# Altium schematic sheet MCU_NODE.SchDoc
size A
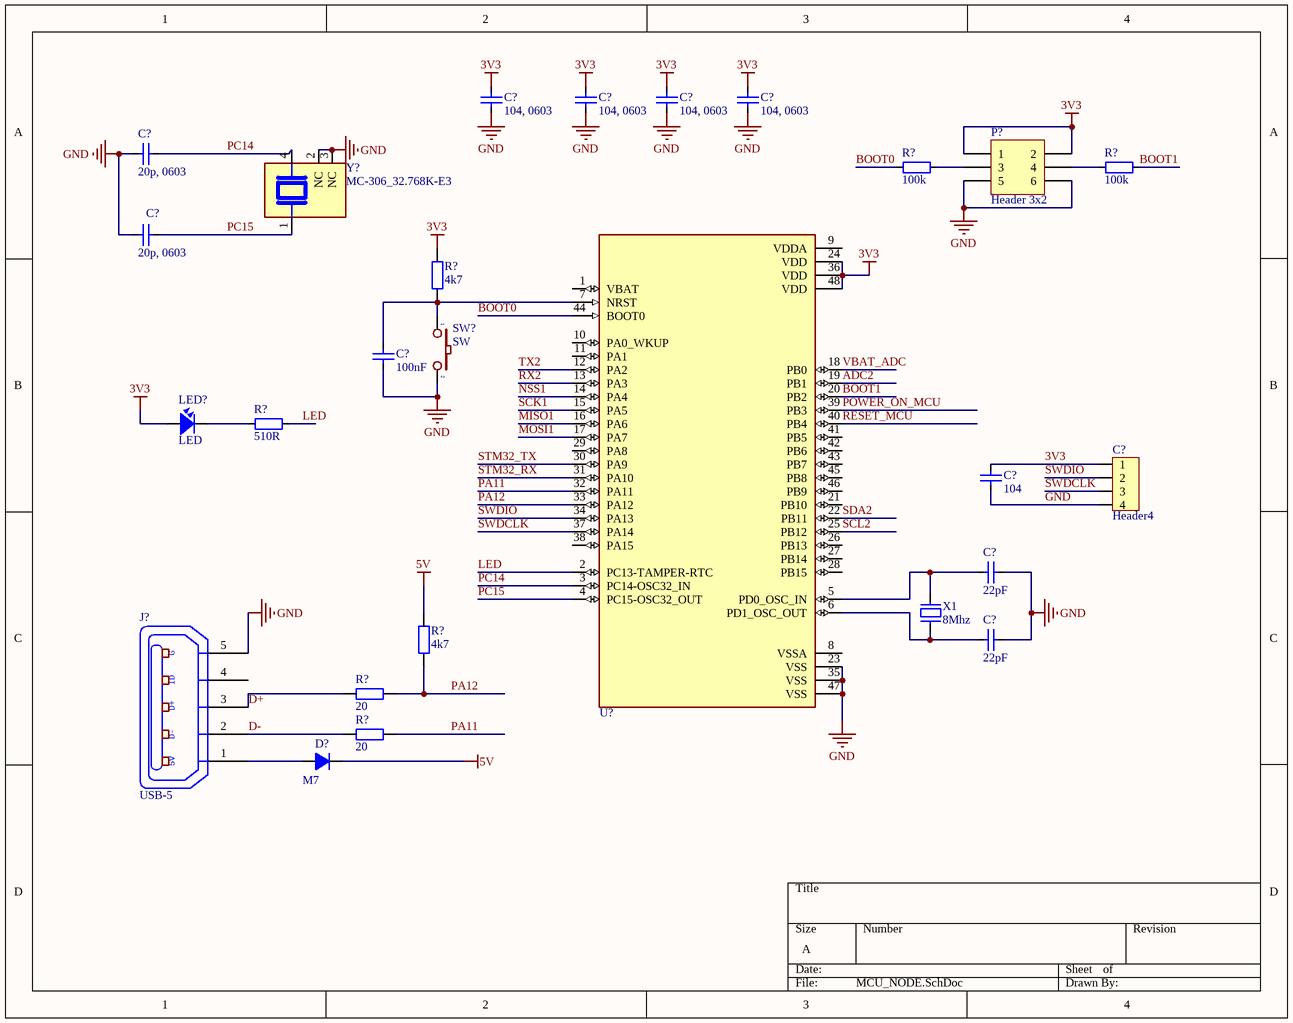
[diagram p0: MCU_NODE.SchDoc]

## Parts
(Parts that share a designator on the sheet are numbered #1, #2 ... from top to bottom, then left to right.)
C?#1  104, 0603  [CAP_0805]
C?#2  104, 0603  [CAP_0805]
C?#3  104, 0603  [CAP_0805]
C?#4  104, 0603  [CAP_0805]
C?#5  20p, 0603  [CAP_0805]
C?#6  20p, 0603  [CAP_0805]
C?#7  100nF  [CAP_0402]
C?#8  Header4  [HDR4]
C?#9  104  [CAP_0402]
C?#10  22pF  [CAP_0402]
C?#11  22pF  [CAP_0402]
D?  M7  [LED-0805-Blue]
J?  USB-5  [USB-M1]
LED?  LED  [LED-0805-Blue]
P?  Header 3x2  [Header 3x2]
R?#1  100k  [RES-SMD-0805]
R?#2  100k  [RES-SMD-0805]
R?#3  4k7  [RES-SMD-0805]
R?#4  510R  [RES-SMD-0805]
R?#5  4k7  [RES-SMD-0805]
R?#6  20  [RES-SMD-0805]
R?#7  20  [RES-SMD-0101]
SW?  SW  [SW2]
U?  STM32  [LQFP 48]  (value not drawn)
X1  8Mhz  [XT2]
Y?  MC-306_32.768K-E3  [XTAL_MC-306_32.768K-E3]

## Nets
3V3: C?#1.2 C?#2.2 C?#3.2 C?#4.2 C?#8.1 C?#9.2 LED?.1 P?.1 P?.2 R?#3.1 U?.24(VDD) U?.36(VDD) U?.48(VDD)
5V: D?.2(K) R?#5.2
GND: C?#1.1 C?#2.1 C?#3.1 C?#4.1 C?#5.1 C?#6.1 C?#7.1 C?#8.4 C?#9.1 C?#10.2 C?#11.2 J?.5(P5) P?.5 P?.6 SW?.2 U?.23(VSS) U?.35(VSS) U?.47(VSS) Y?.2(NC) Y?.3(NC)
ADC2: U?.19(PB1)
BOOT0: R?#1.2 U?.44(BOOT0)
BOOT1: R?#2.1 U?.20(PB2)
D+: J?.3(P3) R?#6.1
D-: J?.2(P2) R?#7.1
LED: R?#4.1 U?.2(PC13-TAMPER-RTC)
MISO1: U?.16(PA6)
MOSI1: U?.17(PA7)
NSS1: U?.14(PA4)
PA11: R?#7.2 U?.32(PA11)
PA12: R?#5.1 R?#6.2 U?.33(PA12)
PC14: C?#5.2 U?.3(PC14-OSC32_IN) Y?.4
PC15: C?#6.2 U?.4(PC15-OSC32_OUT) Y?.1
POWER_ON_MCU: U?.39(PB3)
RESET_MCU: U?.40(PB4)
RX2: U?.13(PA3)
SCK1: U?.15(PA5)
SCL2: U?.25(PB12)
SDA2: U?.22(PB11)
STM32_RX: U?.31(PA10)
STM32_TX: U?.30(PA9)
SWDCLK: C?#8.3 U?.37(PA14)
SWDIO: C?#8.2 U?.34(PA13)
TX2: U?.12(PA2)
VBAT_ADC: U?.18(PB0)
NetC?#7_2: C?#7.2 R?#3.2 SW?.1 U?.7(NRST)
NetC?#10_1: C?#10.1 U?.5(PD0_OSC_IN) X1.2
NetC?#11_1: C?#11.1 U?.6(PD1_OSC_OUT) X1.1
NetD?_1: D?.1(A) J?.1(P1)
NetLED?_2: LED?.2 R?#4.2
NetP?_3: P?.3 R?#1.1
NetP?_4: P?.4 R?#2.2

Not connected (* = marked no-connect by the designer): J? 4(P4); U? 1(VBAT) 8(VSSA) 9(VDDA) 10(PA0_WKUP) 11(PA1) 21(PB10) 26(PB13) 27(PB14) 28(PB15) 29(PA8) 38(PA15) 41(PB5) 42(PB6) 43(PB7) 45(PB8) 46(PB9)

## Notes on the sheet
- (in symbol USB-5) G; ID; D+; D-; 5V

## Library data of the parts
C?#1-C?#7 C?#9-C?#11 = CapSMD: Capacitor; Value: 33p; Published: 8-Jun-2000; LatestRevisionDate: 17-Jul-2002; LatestRevisionNote: Re-released for DXP Platform.; PackageReference: RAD-0.3; Publisher: Altium Limited
C?#8 = Header4: Header IDC, 4 x 1 Pin Vertical 2.54mm Pitch (Non-Boxed, Male); Manufacturer: W¨¹rth Elektronik eiSos GmbH; partNo: 613002143121; ComponentLink1 Description: Manufacturer; ComponentLink2 Description: Datasheet; NoPins: 02; Created Date: 29 March 2013; ComponentLink1URL: http://www.we-online.com; ComponentLink2URL: http://katalog.we-online.de/em/datasheet/6130xx143121.pdf; Created by: Karrer Zheng
D? = D1A: Diode 1A; Value: 1N4007
J? = USB-5: Manufacturer: FCI; Manufacturer Part Number: 10118193-0001LF; Connector Type: USB - micro B; Number of Contacts: 5; Gender: Receptacle; Specifications: USB 2.0; .Creator: MM; .Checked PCB: RF; Supplier 1: Digi-Key; RoHS: RoHS Compliant; Category: Connectors, Interconnects; Stock 1: 28642; Pricing 1: 1=0.46, 10=0.433, 25=0.3712, 50=0.3156, 100=0.3032, 250=0.27224, 500=0.25988 (USD); Packaging: Cut Tape (CT); Mounting Type: Surface Mount, Right Angle, Horizontal; Features: Shielded, Solder Retention; Ingress Protection: -; ComponentLink1URL: http://portal.fciconnect.com/Comergent//fci/drawing/10118193.pdf; ComponentLink1Description: http://portal.fciconnect.com/Comergent//fci/drawing/10118193.pdf; Supplier Part Number 1: 609-4616-1-ND; .Checked SCH: MM
LED? = LED: LED Single colour Green and Red; Value: LED 3 ly Single Colour
P? = Header 3x2: Header, 6-Pin, 2-Row; LatestRevisionDate: 17-Jul-2002; LatestRevisionNote: Re-released for DXP Platform.; Publisher: Altium Limited
R?#1 R?#2 R?#4 = Resistor - SMD: Resistor; Manufacturer: Generic Components; Class: Passive; Published: 08/06/2000; Publisher: Altium Hobart Technology Centre
R?#3 R?#5-R?#7 = Resistor - SMD: Resistor SMD; Manufacturer: Generic Components; Class: Passive; Published: 08/06/2000; Publisher: Altium Hobart Technology Centre
SW? = SW2: Switch button 2 pin; Value: SW chip 2 pin
U? = STM32F103C8T6: STM32 ARM-based 32-bit MCU with 64 Kbytes Flash, 64-pin LQFP, Industrial Temperature
X1 = XT2: Crystal For all Crystal 2pin.; Value: 4Mhz
Y? = MC-306_32.768K-E3: CRYSTAL 32.7680KHZ 6PF SMD; MF: EPSON; MP: MC-306 32.768K-E3; Check_prices: https://www.snapeda.com/parts/MC-306%2032.768K-E3/EPSON/view-part/?ref=eda; Package: NON STANDARD-4 EPSON; Value: *; Price: None; Purchase-URL: https://pricing.snapeda.com/search/part/MC-306 32.768K-E3/?ref=eda; SnapEDA_Link: https://www.snapeda.com/parts/MC-306%2032.768K-E3/EPSON/view-part/?ref=snap; Availability: In Stock